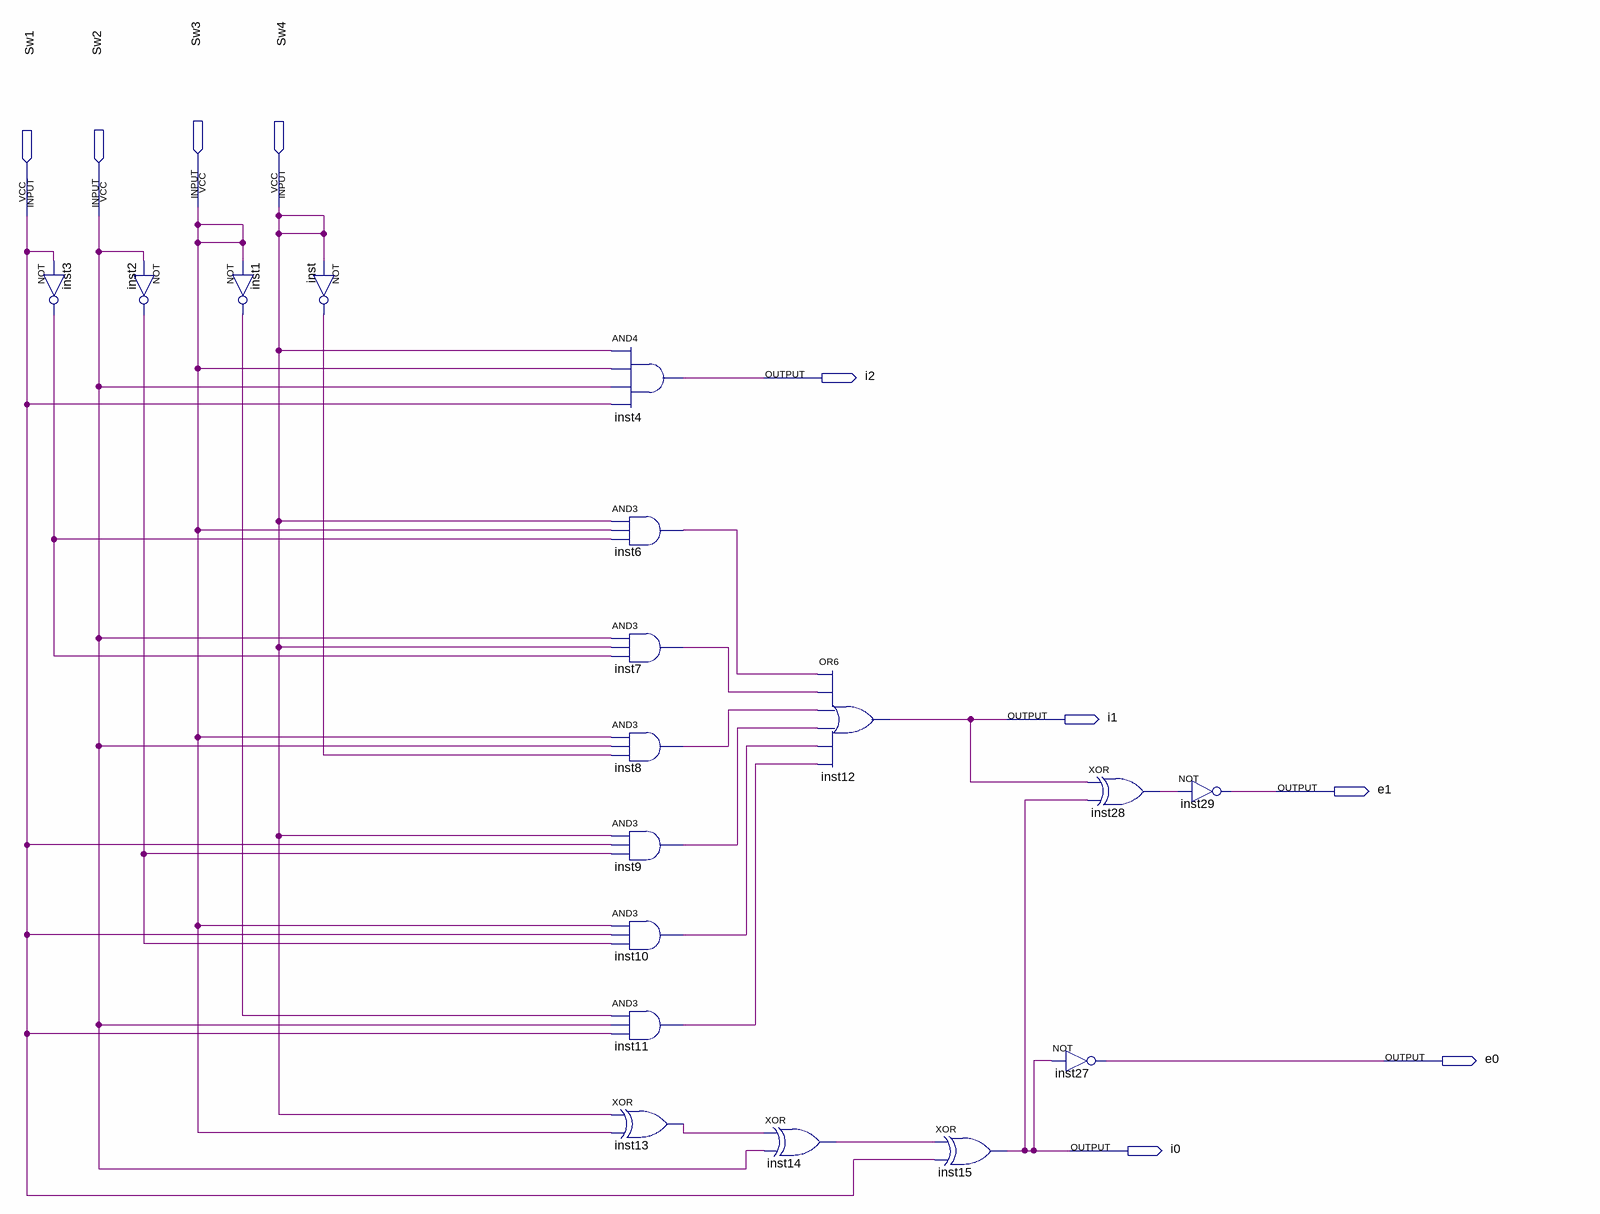
[diagram p0: schematic sheet]
// Quartus schematic counternew.bdf as structural Verilog: 18 symbols, 9 pins
module counternew (
  input  Sw3,
  input  Sw4,
  input  Sw1,
  input  Sw2,
  output i2,
  output i1,
  output e1,
  output e0,
  output i0
);

  wire inst1_out, inst2_out, inst3_out, inst6_out, inst7_out, inst8_out, inst9_out, inst10_out, inst11_out,
       inst13_out, inst14_out, inst28_out, inst_out;

  not inst3 (inst3_out, Sw1);
  not inst2 (inst2_out, Sw2);
  not inst1 (inst1_out, Sw3);
  not inst (inst_out, Sw4);
  and inst4 (i2, Sw4, Sw3, Sw2, Sw1);
  and inst6 (inst6_out, Sw4, Sw3, inst3_out);
  and inst7 (inst7_out, Sw2, Sw4, inst3_out);
  and inst8 (inst8_out, Sw3, Sw2, inst_out);
  and inst9 (inst9_out, Sw4, Sw1, inst2_out);
  and inst10 (inst10_out, Sw3, Sw1, inst2_out);
  and inst11 (inst11_out, inst1_out, Sw2, Sw1);
  xor inst13 (inst13_out, Sw4, Sw3);
  xor inst14 (inst14_out, inst13_out, Sw2);
  or inst12 (i1, inst6_out, inst7_out, inst8_out, inst9_out, inst10_out, inst11_out);
  xor inst15 (i0, inst14_out, Sw1);
  xor inst28 (inst28_out, i1, i0);
  not inst27 (e0, i0);
  not inst29 (e1, inst28_out);
endmodule
